# Altium schematic sheet Top Level.SchDoc
size A4; Author: Author Name; Organization: ORGANIZATION; Address1: ADDRESS 1; Address2: ADDRESS 2; Address3: ADDRESS 3; Address4: ADDRESS 4; Revision: 1; SheetNumber: 1; SheetTotal: 6; ENG_APP_DATE: --/--/--; DSN_APP_DATE: --/--/--; CHK_APP_DATE: --/--/--
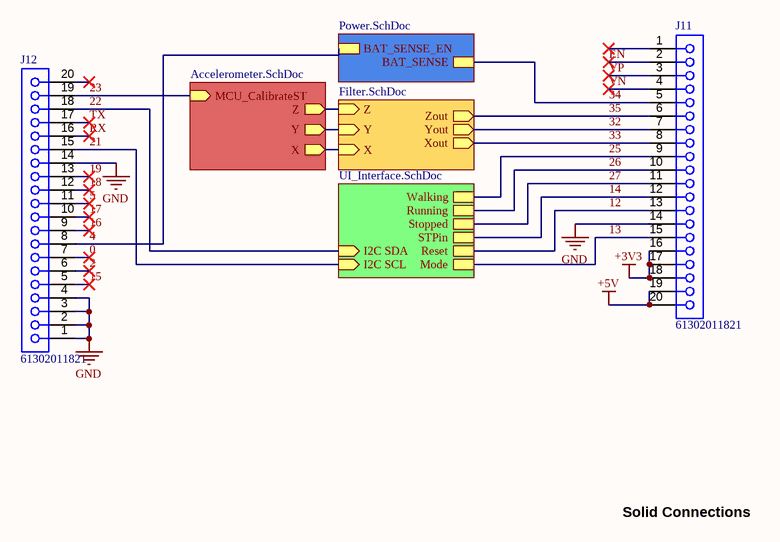
[diagram p0: Top Level.SchDoc]

## Parts
J11  61302011821  [61302011821]
J12  61302011821  [61302011821]

## Sub-sheets
r = UI_Interface.SchDoc: I2C SDA (in), I2C SCL (in), Walking, Running, Stopped, Mode, STPin, Reset
Sheet2 = Power.SchDoc: BAT_SENSE_EN, BAT_SENSE
Sheet3 = Accelerometer.SchDoc: Z (out), Y (out), X (out), MCU_CalibrateST (in)
Sheet4 = Filter.SchDoc: Z (in), Y (in), X (in), Zout (out), Xout (out), Yout (out)

## Nets
+3V3: J11.16 J11.17 J11.18
+5V: J11.19 J11.20
GND: J11.14 J12.1 J12.2 J12.3 J12.4 J12.14
0: J12.7
2: J12.6
4: J12.8 ; sheet Sheet2/BAT_SENSE_EN
5: J12.11
12: J11.13 ; sheet r/Reset
13: J11.15 ; sheet r/Mode
14: J11.12 ; sheet r/STPin
15: J12.5
16: J12.9
17: J12.10
18: J12.12
19: J12.13
21: J12.15 ; sheet r/I2C SCL
22: J12.18 ; sheet r/I2C SDA
23: J12.19 ; sheet Sheet3/MCU_CalibrateST
25: J11.9 ; sheet r/Walking
26: J11.10 ; sheet r/Running
27: J11.11 ; sheet r/Stopped
32: J11.7 ; sheet Sheet4/Yout
33: J11.8 ; sheet Sheet4/Xout
34: J11.5 ; sheet Sheet2/BAT_SENSE
35: J11.6 ; sheet Sheet4/Zout
EN: J11.2
RX: J12.16
TX: J12.17
VN: J11.4
VP: J11.3
(unnamed): sheet Sheet4/Z, sheet Sheet3/Z
(unnamed): sheet Sheet4/Y, sheet Sheet3/Y
(unnamed): sheet Sheet4/X, sheet Sheet3/X

Not connected (* = marked no-connect by the designer): J11 1*; J12 20*

## Notes on the sheet
- Solid Connections
- DWG. NO.
- REV.
- SHT.
- THIS DOCUMENT AND THE DATA DISCLOSED HEREIN OR HEREWITH IS THE PROPERTY OF ALTIUM LIMITED AND MAY BE FREELY DISTRIBUTED IN WHOLE. NO RIGHTS ARE RESERVED OR EXPRESS OR IMPLIED WARANTEE GIVEN.
- REVISION
- DESCRIPTION
- DATE
- APPROVED
- ENG:
- APPROVALS
- PROJECT
- DSN:
- CHK:
- REFERENCE DOCUMENTS
- PROJECT REVISION:
- TITLE
- DOCUMENT REVISION:
- DESIGN ITEM:
- BOM:
- FAB DWG:
- PCB DWG:
- ASSY DWG:
- SCALE:
- SIZE
- B
- CAGE CODE
- FILE NAME
- DWG NO.
- SHEET
- OF
- REV

## Library data of the parts
J11 J12 = CMP-1502-01348-3: NexarPartId: 61924744; Gender: Female; Current Rating: 3A; Operating Supply Voltage: 250V; Contact Resistance: 20mΩ; RoHS: Non-Compliant; Number of Pins: 20; Orientation: Vertical; Lead Pitch: 2.54mm